# Altium schematic sheet Esquema.SchDoc
size A3
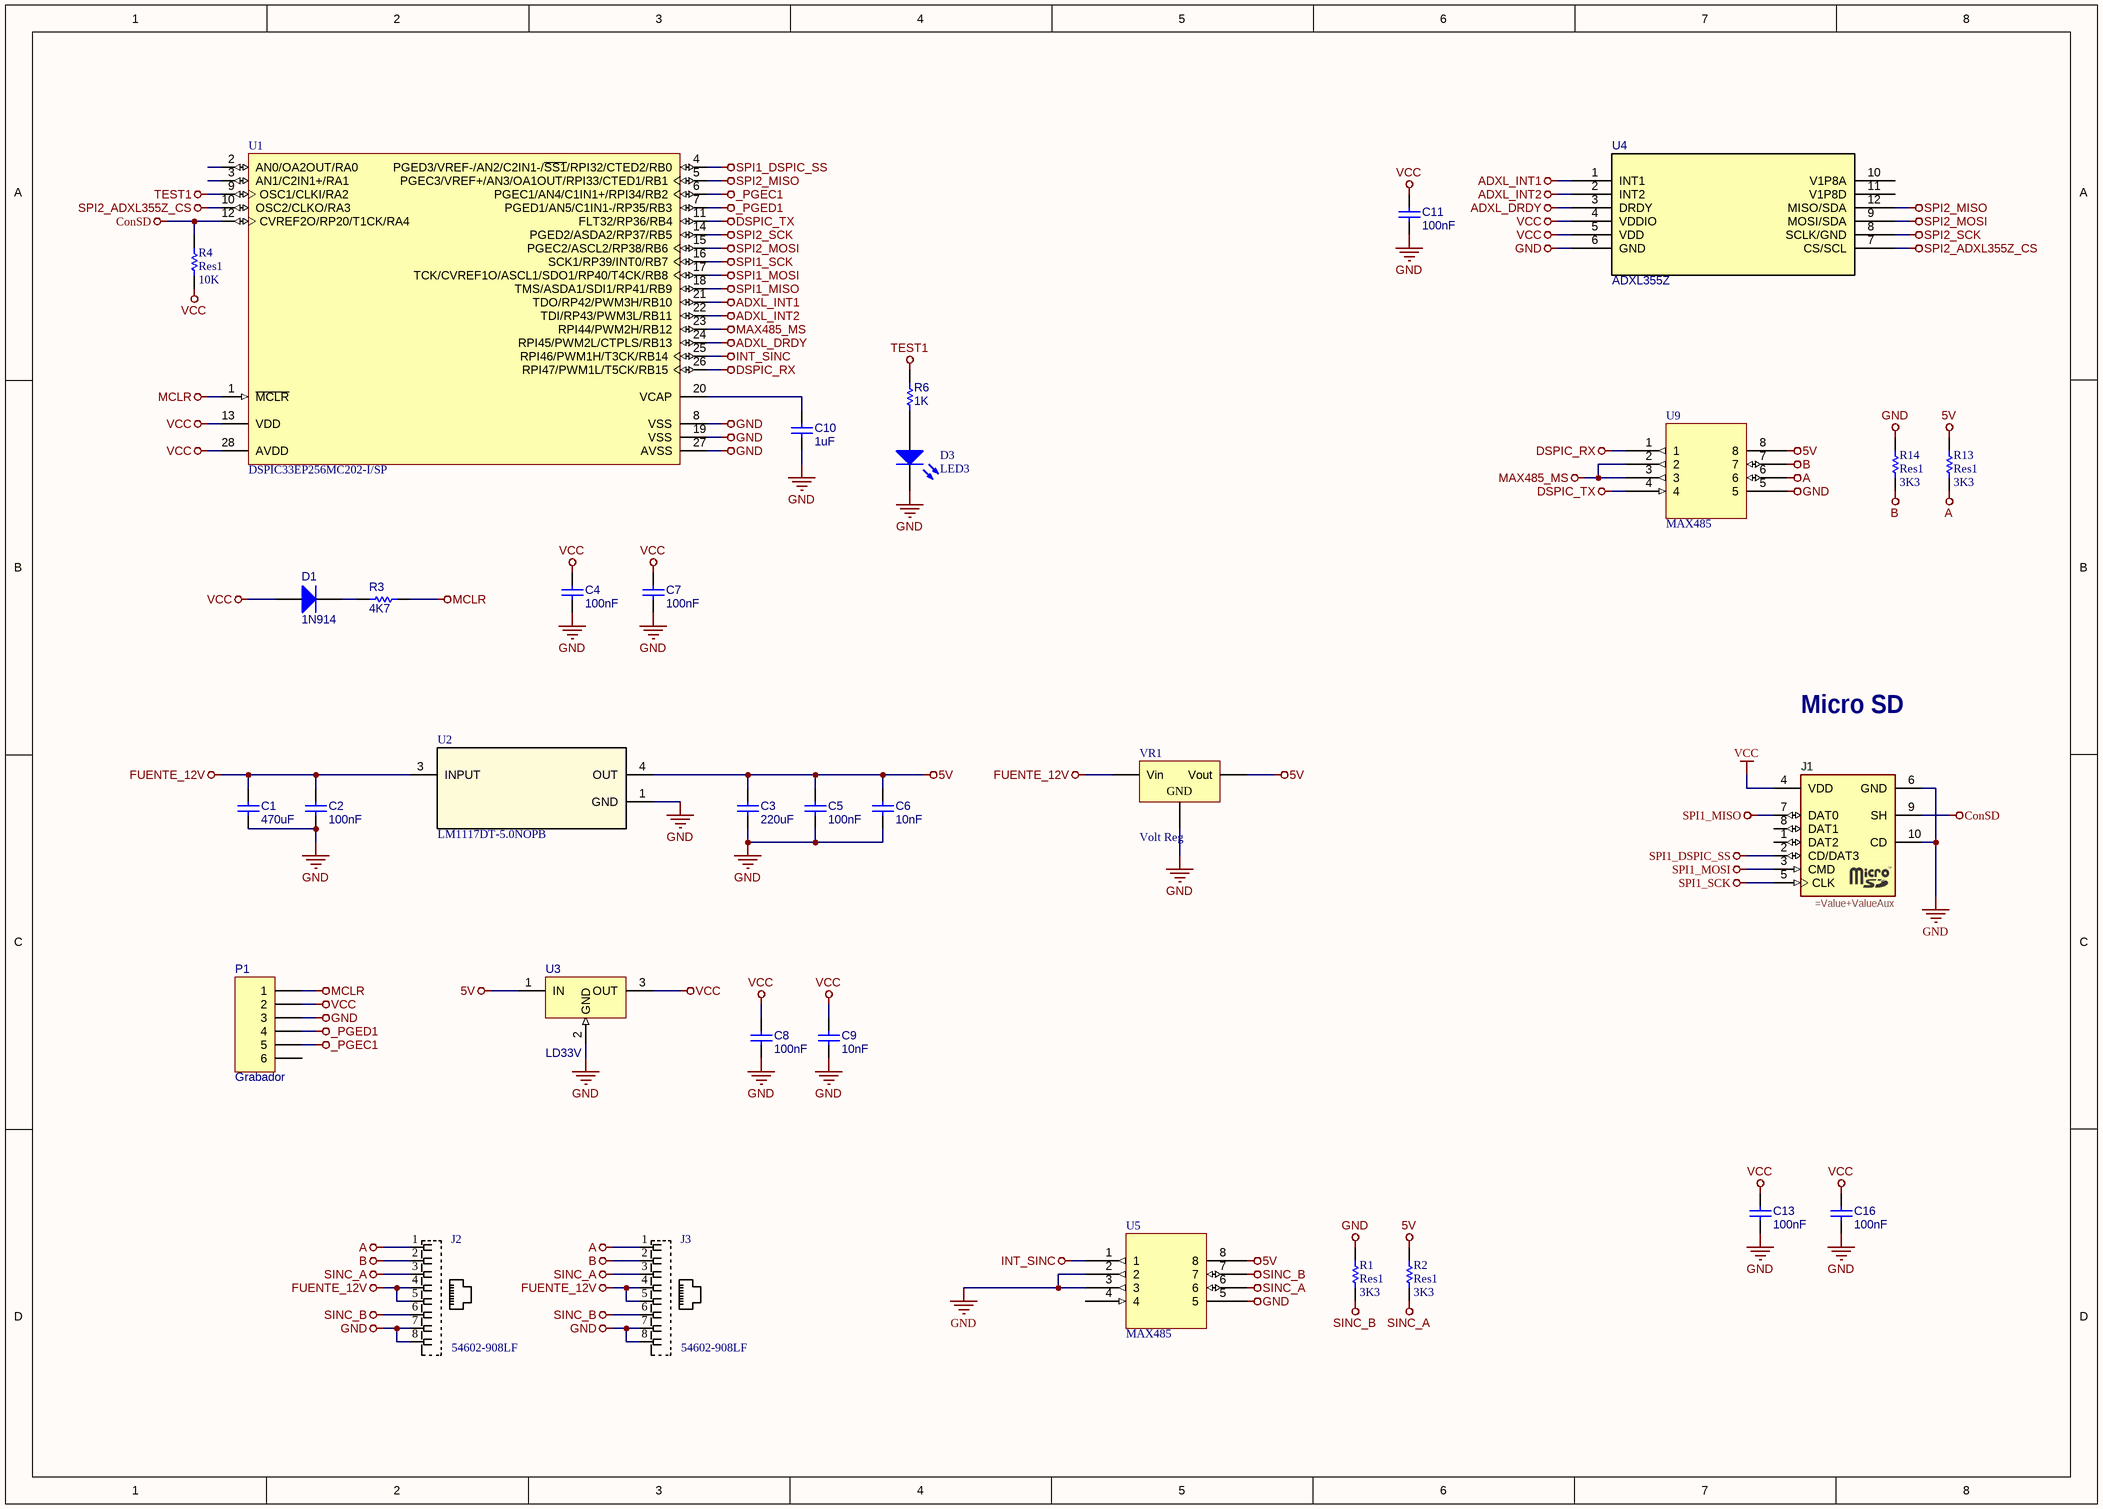
[diagram p0: Esquema.SchDoc]

## Parts
C1  value 470uF  [C100UFB]  (hidden comment: Cap)
C2  value 100nF  [RAD0.2]  (hidden comment: Cap)
C3  value 220uF  [C100UFB]  (hidden comment: Cap)
C4  value 100nF  [RAD0.2]  (hidden comment: Cap)
C5  value 100nF  [RAD0.2]  (hidden comment: Cap)
C6  value 10nF  [RAD0.2]  (hidden comment: Cap)
C7  value 100nF  [RAD0.2]  (hidden comment: Cap)
C8  value 100nF  [RAD0.2]  (hidden comment: Cap)
C9  value 10nF  [RAD0.2]  (hidden comment: Cap)
C10  value 1uF  [RAD0.2]  (hidden comment: Cap)
C11  value 100nF  [RAD0.2]  (hidden comment: Cap)
C13  value 100nF  [RAD0.2]  (hidden comment: Cap)
C16  value 100nF  [RAD0.2]  (hidden comment: Cap)
D1  1N914  [DO-35]
D3  LED3  [LED2]
J1  (no value)  [microSD]
J2  54602-908LF  [RJ45_CONN8_2-908LF_AMP]
J3  54602-908LF  [RJ45_CONN8_2-908LF_AMP]
P1  Grabador  [HDR1X6]
R1  Res1  value 3K3  [AXIAL-0.3]
R2  Res1  value 3K3  [AXIAL-0.3]
R3  value 4K7  [AXIAL-0.3]  (hidden comment: Res1)
R4  Res1  value 10K  [AXIAL-0.3]
R6  value 1K  [AXIAL-0.3]  (hidden comment: Res1)
R13  Res1  value 3K3  [AXIAL-0.3]
R14  Res1  value 3K3  [AXIAL-0.3]
U1  DSPIC33EP256MC202-I/SP  [MCHP-SPDIP-SP28]
U2  LM1117DT-5.0NOPB  [NDP0003B]
U3  LD33V  [SOT-223]
U4  ADXL355Z  [ADXL355Z]
U5  MAX485  [MAX485]
U9  MAX485  [MAX485]
VR1  Volt Reg  [TO-220V]

## Nets
5V: C3.1 C5.1 C6.1 R2.2 R13.2 U2.4(OUT) U3.1(IN) U5.8 U9.8 VR1.3(Vout)
_PGEC1: P1.5 U1.6(PGEC1/AN4/C1IN1+/RPI34/RB2)
_PGED1: P1.4 U1.7(PGED1/AN5/C1IN1-/RP35/RB3)
A: J2.1 J3.1 R13.1 U9.6
ADXL_DRDY: U1.24(RPI45/PWM2L/CTPLS/RB13) U4.3(DRDY)
ADXL_INT1: U1.21(TDO/RP42/PWM3H/RB10) U4.1(INT1)
ADXL_INT2: U1.22(TDI/RP43/PWM3L/RB11) U4.2(INT2)
B: J2.2 J3.2 R14.1 U9.7
ConSD: J1.9(SH) R4.2 U1.12(CVREF2O/RP20/T1CK/RA4)
DSPIC_RX: U1.26(RPI47/PWM1L/T5CK/RB15) U9.1
DSPIC_TX: U1.11(FLT32/RP36/RB4) U9.4
FUENTE_12V: C1.1 C2.1 J2.4 J2.5 J3.4 J3.5 U2.3(INPUT) VR1.1(Vin)
GND: C1.2 C2.2 C3.2 C4.2 C5.2 C6.2 C7.2 C8.2 C9.2 C10.2 C11.2 C13.2 C16.2 D3.2(K) J1.6(GND) J1.10(CD) J2.7 J2.8 J3.7 J3.8 P1.3 R1.2 R14.2 U1.8(VSS) U1.19(VSS) U1.27(AVSS) U2.1(GND) U3.2(GND) U4.6(GND) U5.2 U5.3 U5.5 U9.5 VR1.2(GND)
INT_SINC: U1.25(RPI46/PWM1H/T3CK/RB14) U5.1
MAX485_MS: U1.23(RPI44/PWM2H/RB12) U9.2 U9.3
MCLR: P1.1 R3.1 U1.1(~{MCLR})
SINC_A: J2.3 J3.3 R2.1 U5.6
SINC_B: J2.6 J3.6 R1.1 U5.7
SPI1_DSPIC_SS: J1.2(CD/DAT3) U1.4(PGED3/VREF-/AN2/C2IN1-/~{SS1}/RPI32/CTED2/RB0)
SPI1_MISO: J1.7(DAT0) U1.18(TMS/ASDA1/SDI1/RP41/RB9)
SPI1_MOSI: J1.3(CMD) U1.17(TCK/CVREF1O/ASCL1/SDO1/RP40/T4CK/RB8)
SPI1_SCK: J1.5(CLK) U1.16(SCK1/RP39/INT0/RB7)
SPI2_ADXL355Z_CS: U1.10(OSC2/CLKO/RA3) U4.7(CS/SCL)
SPI2_MISO: U1.5(PGEC3/VREF+/AN3/OA1OUT/RPI33/CTED1/RB1) U4.12(MISO/SDA)
SPI2_MOSI: U1.15(PGEC2/ASCL2/RP38/RB6) U4.9(MOSI/SDA)
SPI2_SCK: U1.14(PGED2/ASDA2/RP37/RB5) U4.8(SCLK/GND)
TEST1: R6.1 U1.9(OSC1/CLKI/RA2)
VCC: C4.1 C7.1 C8.1 C9.1 C11.1 C13.1 C16.1 D1.1(A) J1.4(VDD) P1.2 R4.1 U1.13(VDD) U1.28(AVDD) U3.3(OUT) U4.4(VDDIO) U4.5(VDD)
NetC10_1: C10.1 U1.20(VCAP)
NetD1_2: D1.2(K) R3.2
NetD3_1: D3.1(A) R6.2

Not connected (* = marked no-connect by the designer): J1 1(DAT2) 8(DAT1); P1 6; U1 2(AN0/OA2OUT/RA0) 3(AN1/C2IN1+/RA1); U4 10(V1P8A) 11(V1P8D); U5 4

## Notes on the sheet
- Micro SD

## Library data of the parts
C1-C11 C13 C16 = Cap: Capacitor; Published: 8-Jun-2000; LatestRevisionDate: 17-Jul-2002; LatestRevisionNote: Re-released for DXP Platform.; PackageReference: RAD-0.3; Publisher: Altium Limited; PackageDescription: Radial Cap, Thru-Hole; 2 Leads; 0.3 in Pin Spacing
D1 = Diode 1N914: High Conductance Fast Diode; Published: 8-Jun-2000; LatestRevisionDate: 17-Jul-2002; LatestRevisionNote: Re-released for DXP Platform.; DatasheetVersion: 1997; PackageReference: DO-35; Publisher: Altium Limited; PackageDescription: Diode, Axial; Body 3.8 x 1.9 mm (LxDia. max), Lead Dia. 0.53 mm (max); Code_JEDEC: DO-204-AH; ComponentLink1Description: Manufacturer Link; ComponentLink1URL: http://www.fairchildsemi.com/; ComponentLink2Description: Datasheet; ComponentLink2URL: http://www.fairchildsemi.com/ds/1N%2F1N4448.pdf
D3 = LED3: Typical BLUE SiC LED; Published: 8-Jun-2000; LatestRevisionDate: 17-Dec-2003; LatestRevisionNote: PCB Footprint replaced.; DatasheetVersion: 16-Apr-2002; PackageVersion: 16-Apr-2002; PackageReference: 3.5X2.8X1.9; Publisher: Altium Limited; PackageDescription: SM LED; 2 C-Bend Leads; Body 3.5 x 2.8 x 1.9 mm, inc leads (LxWxH typ)
J1 = MICROSD: =Description
J2 J3 = 54602-908LF: Jack Modular Connector 8p8c _RJ45, Ethernet_ 90Â° Angle _Right_ Unshielded Cat3; MF: Amphenol ICC; Digi-Key_Part_Number: 609-1046-ND; MP: 54602-908LF; SnapEDA_Link: https://www.snapeda.com/parts/54602-908LF/Amphenol%20FCI/view-part/1356963/?ref=snap; Package: None; Digi-Key_Purchase_URL: https://www.digikey.com/product-detail/en/amphenol-icc-fci/54602-908LF/609-1046-ND/1001360?utm_source=snapeda&utm_medium=aggregator&utm_campaign=symbol; Value: *
P1 = Header 6: Header, 6-Pin; LatestRevisionDate: 17-Jul-2002; LatestRevisionNote: Re-released for DXP Platform.; Publisher: Altium Limited
R1-R4 R6 R13 R14 = Res1: Resistor; Published: 8-Jun-2000; LatestRevisionDate: 17-Jul-2002; LatestRevisionNote: Re-released for DXP Platform.; PackageReference: AXIAL-0.3; Publisher: Altium Limited; PackageDescription: Axial Device, Thru-Hole; 2 Leads; 0.3 in Pin Spacing
U1 = DSPIC33EP256MC202-I/SP: 16-Bit Microcontroller and Digital Signal Controller with High-Speed PWM, Op Amps and Advanced Analog, 70 MIPS, 21 I/O, GPIO, -40 to 85 degC, 28-pin SPDIP (SP28), Tube; Manufacturer: Microchip; DatasheetVersion: Rev. F; PackageVersion: C04-070B; PackageReference: SPDIP-SP28; PackageDescription: 28-Lead Plastic Dual In-Line, 34.86 x 6.79 mm Body, 2.54 mm Pitch; Supplier 1: Digi-Key; Supplier Part Number 1: DSPIC33EP256MC202-I/SP-ND; Supplier 2: Farnell; Supplier Part Number 2: 2212194; Supplier 3: Newark; Supplier Part Number 3: 66T8001; Supplier 4: Mouser; Supplier Part Number 4: 579-PC33256MC202ISP; Mounting Technology: Through Hole; PartNumber: DSPIC33EP256MC202-I/SP; ComponentLink1Description: Manufacturer URL; ComponentLink1URL: http://www.microchip.com; ComponentLink2Description: Datasheet; ComponentLink2URL: http://ww1.microchip.com/downloads/en/DeviceDoc/70657F.pdf; ComponentLink3Description: Package Specification; ComponentLink3URL: http://www.microchip.com/stellent/groups/techpub_sg/documents/packagingspec/en012702.pdf; ComponentLink4Description: Product URL; ComponentLink4URL: http://www.microchip.com/dsPIC33EP256MC202
U2 = LM1117DT-5.0NOPB: No Description Available; Mfr_Name: Texas Instruments; TYPE: TYPE; RefDes: RefDes
U3 = LD33V: High-Performance 16-bit Digital Signal Controller, 24 KB Flash, 2 KB SRAM, 1 KB EEPROM, 40-Pin PDIP, Industrial Temperature
VR1 = Volt Reg: Voltage Regulator; Published: 24-Mar-1999; LatestRevisionDate: 29-May-2009; LatestRevisionNote: IPC-7351 Footprint Added.; PackageReference: D2PAK; Publisher: Altium Limited; PackageDescription: 3-Pin Transistor Outline Package 2.54 mm Pitch, 15.1 mm Lead Span